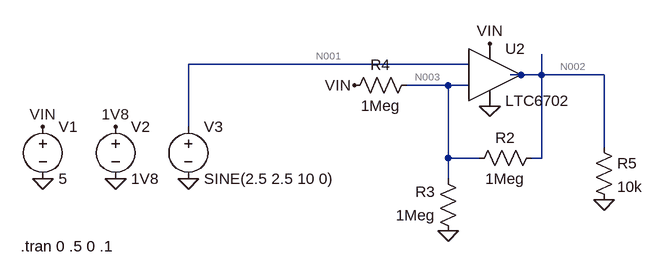
[diagram p0: schematic Draft1.asc]
Draft1.asc, the LTspice schematic file:
Version 4
SHEET 1 880 680
WIRE 112 128 -320 128
WIRE 192 144 176 144
WIRE 224 144 224 112
WIRE 224 144 192 144
WIRE 320 144 224 144
WIRE 80 160 16 160
WIRE 112 160 80 160
WIRE 144 192 144 176
WIRE -320 224 -320 128
WIRE 320 256 320 144
WIRE 80 272 80 160
WIRE 128 272 80 272
WIRE 224 272 224 144
WIRE 224 272 208 272
WIRE 80 304 80 272
FLAG 144 96 VIN
FLAG -544 304 0
FLAG -432 304 0
FLAG -320 304 0
FLAG 144 192 0
FLAG 80 384 0
FLAG -544 224 VIN
FLAG -432 224 1V8
FLAG 320 336 0
FLAG -64 160 VIN
SYMBOL res 224 256 R90
WINDOW 0 0 56 VBottom 2
WINDOW 3 32 56 VTop 2
SYMATTR InstName R2
SYMATTR Value 1Meg
SYMBOL res 96 400 R180
WINDOW 0 36 76 Left 2
WINDOW 3 36 40 Left 2
SYMATTR InstName R3
SYMATTR Value 1Meg
SYMBOL res -80 176 R270
WINDOW 0 32 56 VTop 2
WINDOW 3 0 56 VBottom 2
SYMATTR InstName R4
SYMATTR Value 1Meg
SYMBOL voltage -544 208 R0
WINDOW 123 0 0 Left 2
WINDOW 39 0 0 Left 2
SYMATTR InstName V1
SYMATTR Value 5
SYMBOL voltage -432 208 R0
WINDOW 123 0 0 Left 2
WINDOW 39 0 0 Left 2
SYMATTR InstName V2
SYMATTR Value 1V8
SYMBOL voltage -320 208 R0
WINDOW 123 0 0 Left 2
WINDOW 39 0 0 Left 2
SYMATTR InstName V3
SYMATTR Value SINE(2.5 2.5 10 0)
SYMBOL res 304 240 R0
SYMATTR InstName R5
SYMATTR Value 10k
SYMBOL Comparators\\LTC6702 144 144 R0
SYMATTR InstName U2
TEXT -578 408 Left 2 !.tran 0 .5 0 .1

The netlist it stands for:
* Draft1.asc
R2 N002 N003 1Meg
R3 0 N003 1Meg
R4 VIN N003 1Meg
V1 VIN 0 5
V2 1V8 0 1V8
V3 N001 0 SINE(2.5 2.5 10 0)
R5 N002 0 10k
XU2 N003 N001 VIN 0 N002 LTC6702
.tran 0 .5 0 .1
.lib LTC3.lib
.backanno
.end

* Results of the author's LTspice run, read from the files saved beside the schematic
* Operating Point, zero values left out:
*   V(n002) = 7.577 µV
*   V(n003) = 1.667 V
*   V(vin) = 5 V
*   V(1v8) = 1 V
*   V(n001) = 2.5 V
*   I(R5) = 757.7 pA
*   I(R4) = 3.333 µA
*   I(R3) = -1.667 µA
*   I(R2) = -1.667 µA
*   I(V3) = -22.5 pA
*   I(V1) = -27.4 µA
*   Ix(u2:1) = 21.67 pA
*   Ix(u2:2) = 22.5 pA
*   Ix(u2:3) = 24.07 µA
*   Ix(u2:4) = -25.74 µA
*   Ix(u2:5) = 1.666 µA
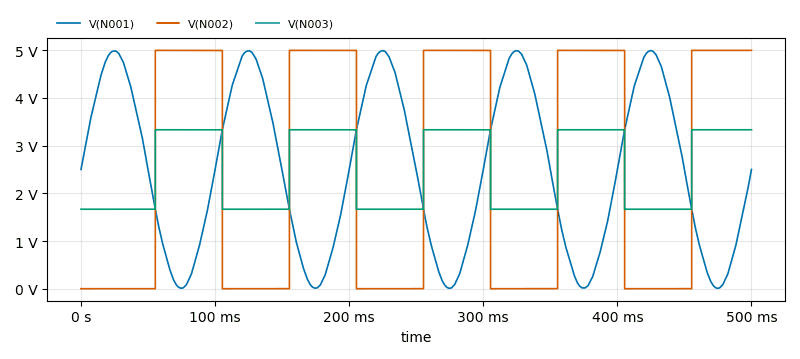
[diagram p1: Transient Analysis of Draft1.asc, plotted from the saved traces]
* Transient Analysis, 1 run:
*   V(N001): min 8.07 mV, max 4.994 V, average 2.495 V, rms 3.049 V, last 2.5 V
*   V(N002): min -1.414 mV, max 4.997 V, average 2.444 V, rms 3.495 V, last 4.997 V
*   V(N003): min 1.667 V, max 3.333 V, average 2.481 V, rms 2.617 V, last 3.332 V